# Altium schematic sheet Obwod_sterowania_MOSFET.SchDoc
size A4
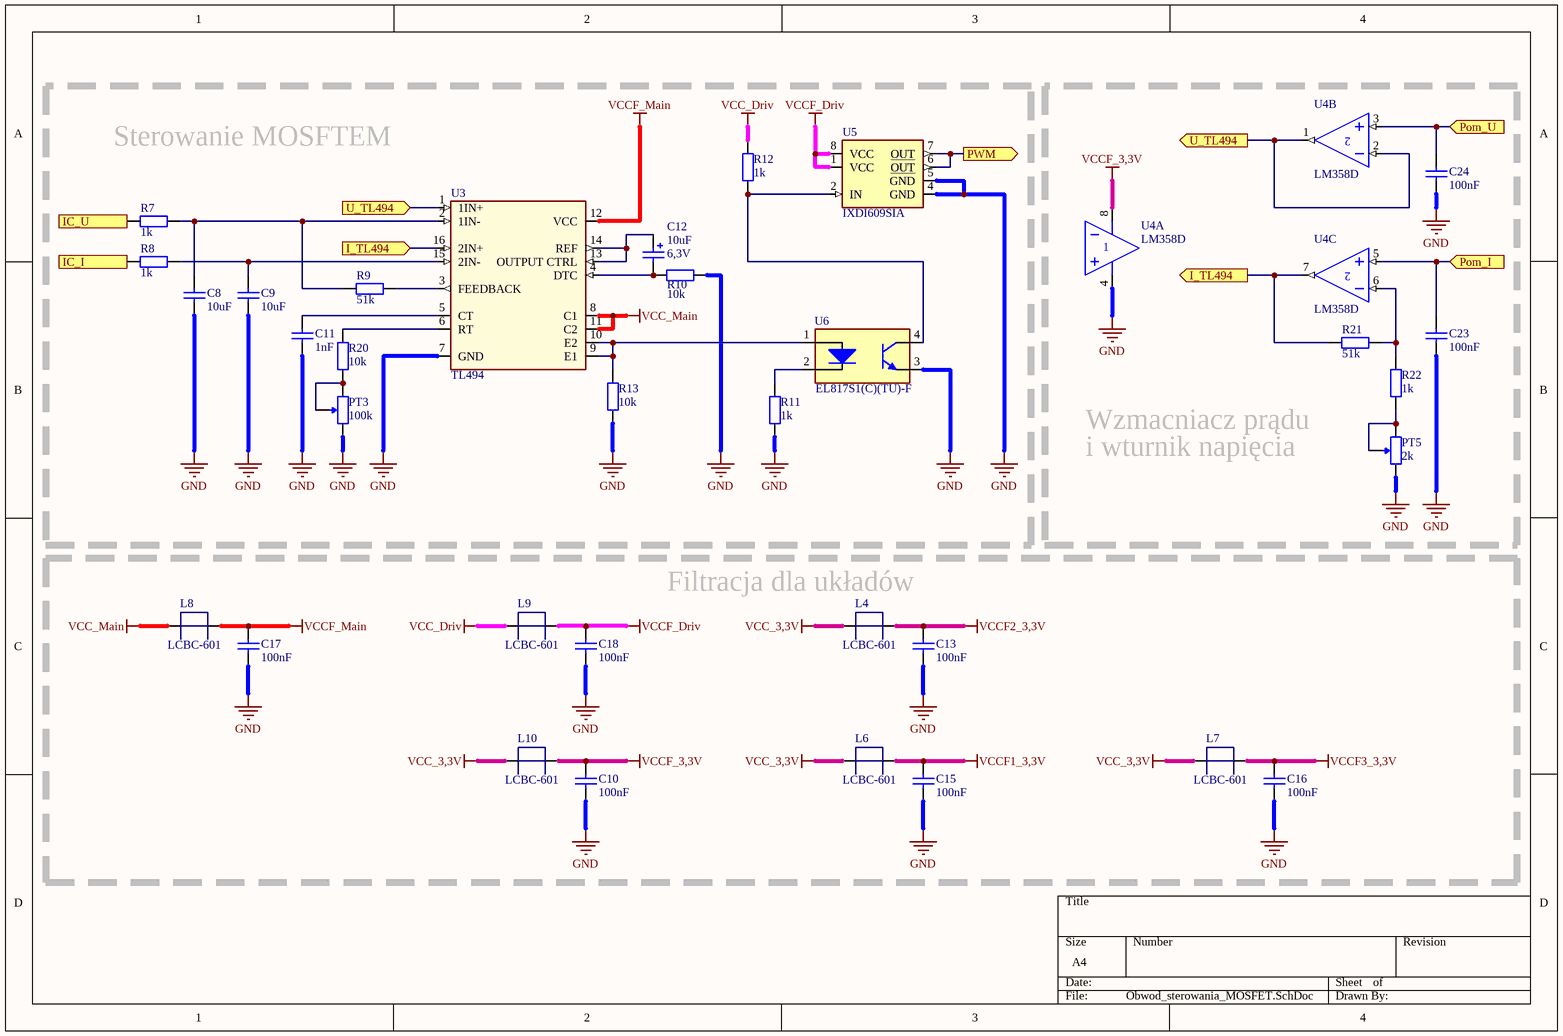
[diagram p0: Obwod_sterowania_MOSFET.SchDoc]

## Parts
C8  Parametr_1: 10uF  [SMD-1206C]  (hidden comment: Kondesator)
C9  Parametr_1: 10uF  [SMD-1206C]  (hidden comment: Kondesator)
C10  Parametr_1: 100nF  [SMD-1206C]  (hidden comment: Kondesator)
C11  Parametr_1: 1nF  [SMD-1206C]  (hidden comment: Kondesator)
C12  Parametr_1: 10uF  Parametr_2: 6,3V  [SMD-1206C]  (hidden comment: Kondesator elektrolityczny)
C13  Parametr_1: 100nF  [SMD-1206C]  (hidden comment: Kondesator)
C15  Parametr_1: 100nF  [SMD-1206C]  (hidden comment: Kondesator)
C16  Parametr_1: 100nF  [SMD-1206C]  (hidden comment: Kondesator)
C17  Parametr_1: 100nF  [SMD-1206C]  (hidden comment: Kondesator)
C18  Parametr_1: 100nF  [SMD-1206C]  (hidden comment: Kondesator)
C23  Parametr_1: 100nF  [SMD-1206C]  (hidden comment: Kondesator)
C24  Parametr_1: 100nF  [SMD-1206C]  (hidden comment: Kondesator)
L4  Oznaczenie: LCBC-601  [SMD-1206-RES]
L6  Oznaczenie: LCBC-601  [SMD-1206-RES]
L7  Oznaczenie: LCBC-601  [SMD-1206-RES]
L8  Oznaczenie: LCBC-601  [SMD-1206-RES]
L9  Oznaczenie: LCBC-601  [SMD-1206-RES]
L10  Oznaczenie: LCBC-601  [SMD-1206-RES]
PT3  Parametr_1: 100k  [Potecjomert]  (hidden comment: Potentiometer)
PT5  Parametr_1: 2k  [Potecjomert]  (hidden comment: Potentiometer)
R7  Parametr_1: 1k  [SMD-1206-RES]  (hidden comment: Rezystor)
R8  Parametr_1: 1k  [SMD-1206-RES]  (hidden comment: Rezystor)
R9  Parametr_1: 51k  [SMD-1206-RES]  (hidden comment: Rezystor)
R10  Parametr_1: 10k  [SMD-1206-RES]  (hidden comment: Rezystor)
R11  Parametr_1: 1k  [SMD-1206-RES]  (hidden comment: Rezystor)
R12  Parametr_1: 1k  [SMD-1206-RES]  (hidden comment: Rezystor)
R13  Parametr_1: 10k  [SMD-1206-RES]  (hidden comment: Rezystor)
R20  Parametr_1: 10k  [SMD-1206-RES]  (hidden comment: Rezystor)
R21  Parametr_1: 51k  [SMD-1206-RES]  (hidden comment: Rezystor)
R22  Parametr_1: 1k  [SMD-1206-RES]  (hidden comment: Rezystor)
U3  TL494  [SOP16]
U4  LM358D  [SOIC8]  (parts A,B,C of 3)
U5  IXDI609SIA  [SO8]
U6  Transoptor  [S1]  (value not drawn)

## Blocks framed on the sheet
Sterowanie MOSFTEM: C8 C9 C11 C12 PT3 R7-R13 R20 U3 U5 U6

## Ports
I_TL494 (in), I_TL494 (out), IC_I (in), IC_U (in), Pom_I (in), Pom_U (in), PWM (out), U_TL494 (in), U_TL494 (out)

## Nets
GND: C8.1 C9.1 C10.1 C11.1 C13.1 C15.1 C16.1 C17.1 C18.1 C23.1 C24.1 PT3.3(BOT) PT5.3(BOT) R10.2 R11.1 R13.1 U3.7(GND) U4.4(V-) U5.4(GND) U5.5(GND) U6.3
VCC_3,3V: L4.1 L6.1 L7.1 L10.1
VCC_Driv: L9.1 R12.2
VCC_Main: L8.1 U3.8(C1) U3.11(C2)
VCCF1_3,3V: C15.2 L6.2
VCCF2_3,3V: C13.2 L4.2
VCCF3_3,3V: C16.2 L7.2
VCCF_3,3V: C10.2 L10.2 U4.8(V+)
VCCF_Driv: C18.2 L9.2 U5.1(VCC) U5.8(VCC)
VCCF_Main: C17.2 L8.2 U3.12(VCC)
I_TL494: R21.2 U3.16(2IN+) U4.7(OUT) ; port I_TL494
IC_I: R8.1 ; port IC_I
IC_U: R7.1 ; port IC_U
Pom_I: C23.2 U4.5(IN+) ; port Pom_I
Pom_U: C24.2 U4.3(IN+) ; port Pom_U
PWM: U5.6(OUT) U5.7(OUT) ; port PWM
U_TL494: U3.1(1IN+) U4.1(OUT) U4.2(IN-) ; port U_TL494
NetC8_2: C8.2 R7.2 R9.2 U3.2(1IN-)
NetC9_2: C9.2 R8.2 U3.15(2IN-)
NetC11_2: C11.2 U3.5(CT)
NetC12_1: C12.1 R10.1 U3.4(DTC)
NetC12_2: C12.2 U3.13(OUTPUT_CTRL) U3.14(REF)
NetPT3_1: PT3.1(TOP) PT3.2(TAP) R20.2
NetPT5_1: PT5.1(TOP) PT5.2(TAP) R22.2
NetR9_1: R9.1 U3.3(FEEDBACK)
NetR11_2: R11.2 U6.2
NetR12_1: R12.1 U5.2(IN) U6.4
NetR13_2: R13.2 U3.9(E1) U3.10(E2) U6.1
NetR20_1: R20.1 U3.6(RT)
NetR21_1: R21.1 R22.1 U4.6(IN-)

## Notes on the sheet
- Wzmacniacz prądu
- (near PT5) i wturnik napięcia
- Filtracja dla układów

## Library data of the parts
C8-C11 C13 C15-C18 C23 C24 = Kondesator: Dostawca: TME; Montaż: SMD; Obudowa: 1206; Parametr_2: Napięcie:; Parametr_3: Tolerancja:; Parametr_4: Temperatura pracy:; Nazwa: Kondesator
  C8 C9: Kod TME: CL31A106KAHNNNE
  C10 C13 C15-C18: Kod TME: 1206B104K500CT
  C11 C23 C24: Kod TME: CL31B102KBCNNNC
C12 = Kondesator elektrolityczny: Dostawca: TME; Parametr_3: Tolerancja:; Parametr_4: Czas życzia:; Parametr_5: Temperatura pracy:; Nazwa: Kondesator elektrolityczny
L4 L6-L10 = Filtr: Montaż: SMD; Obudowa: 1206; Kod TME: LCBC-601; Nazwa: Filtr
PT3 PT5 = Potentiometer: Potentiometer montażowy wielobortowy; Parametr_2: Moc:; Parametr_3: Tolerancja:; Parametr_4: Charakterystyka:; Parametr_5: Temperatura pracy:; Parametr_6: Max nap. pracy:; Nazwa: Potentiometer montażowy wielobortowy
R7-R13 R20-R22 = Rezystor: Parametr_2: Moc:; Parametr_3: Tolerancja:; Parametr_4: Max nap. pracy:; Parametr_5: Max nap impulsowe:; Nazwa: Rezystor
  R7 R8: Kod TME: CRCW12061K00JNTABC
  R9-R13 R20-R22: Kod TME: SMD1206-51K
U3 = TL494: DC/DC switcher, kontroler PWM; Parametr_1: Prąd wyjściowy: 0,25A; Parametr_2: Częstotliwość: 300kHz; Parametr_3: Liczba kanałów: 2; Parametr_4: Temperatura pracy: 0-70C; Parametr_5: Napięcie pracy: 7-40V; Nazwa: DC/DC switcher, kontroler PWM; Oznaczenie: TL494
U4 = LM358D: Wzmacniacz operacyjny; Parametr_1: Pasmo przenoszenia: 1,1MHz; Parametr_2: Liczba kanałów: 2; Parametr_3: Szybkość narastania nap.:  0,6V/us; Parametr_4: Teperatura pracy: 0-70C; Parametr_5: Npa. zasilania: 3-30V; Nazwa: Wzmacniacz operacyjny; Oznaczenie: LM358D
U5 = IXDI609SIA: driver MOSFET; Dostawca: TME; Montaż: SMD; Parametr_1: Prad: -9-9A; Parametr_2: Nap. zasilania: 4,5-35V; Parametr_3: 1 kanał odwracajcy; Producent: IXYS; Nazwa: driver MOSFET; Obudowa: SO8; Kod_TME: IXDI609SIA; Oznaczenie: IXDI609SIA
U6 = EL817S1(C)(TU)-F: Kondesator elektrolityczny; Nazwa: Tranzoptor; Kod TME: EL817S1-C-TU-F; Oznaczenie: EL817S1(C)(TU)-F